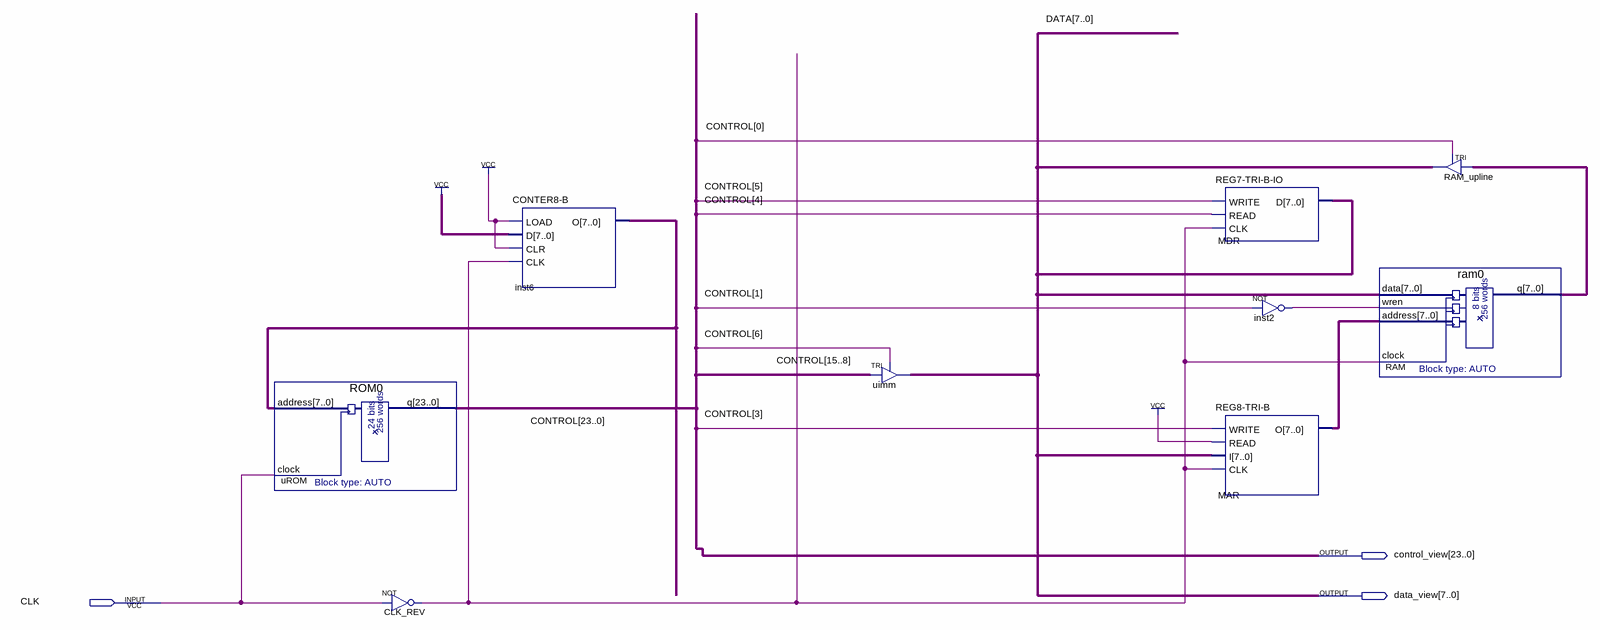
[diagram p0: schematic sheet]
// Quartus schematic EXP2.bdf as structural Verilog: 9 symbols, 3 pins
module EXP2 (
  input  CLK,
  output [23:0] control_view,
  output [7:0] data_view
);

  wire CLK_REV_out, inst2_out;
  wire [7:0] inst6_o, MAR_o, RAM_q;

  ROM0 uROM (.address(inst6_o), .clock(CLK), .q(control_view));
  not CLK_REV (CLK_REV_out, CLK);
  \CONTER8-B  inst6 (.LOAD(1'b1), .D({8{1'b1}}), .CLR(1'b1), .CLK(CLK_REV_out), .O(inst6_o));
  TRI uimm[7:0] (.IN(control_view[15:8]), .OE(control_view[6]), .OUT(data_view));
  \REG7-TRI-B-IO  MDR (.WRITE(control_view[5]), .READ(control_view[4]), .CLK(CLK_REV_out), .D(data_view));
  \REG8-TRI-B  MAR (.WRITE(control_view[3]), .READ(1'b1), .I(data_view), .CLK(CLK_REV_out), .O(MAR_o));
  not inst2 (inst2_out, control_view[1]);
  ram0 RAM (.data(data_view), .wren(inst2_out), .address(MAR_o), .clock(CLK_REV_out), .q(RAM_q));
  TRI RAM_upline[7:0] (.IN(RAM_q), .OE(control_view[0]), .OUT(data_view));

  // Other names for the same wires on the sheet: CONTROL[23:0] = control_view; DATA[7:0] = data_view
endmodule
